# Altium schematic sheet Overview.SchDoc
size A
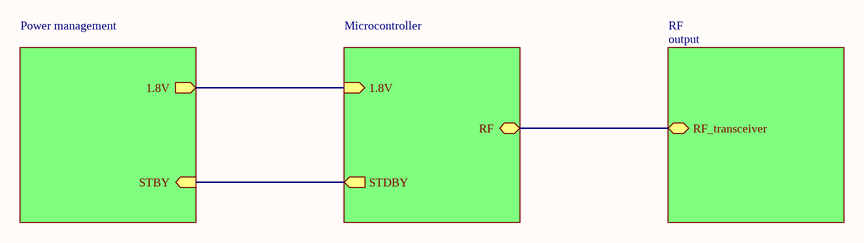
[diagram p0: Overview.SchDoc]

## Sub-sheets
Microcontroller = microcontroller: RF (bidir), 1.8V (in), STDBY (out)
Power management = power_management: 1.8V (out), STBY (in)
RF  = output: RF_transceiver (bidir)

## Nets
(unnamed): sheet Power management/1.8V, sheet Microcontroller/1.8V
(unnamed): sheet Power management/STBY, sheet Microcontroller/STDBY
(unnamed): sheet Microcontroller/RF, sheet RF /RF_transceiver